# Altium schematic sheet Connectors.SchDoc: RasPiCompute_Connectors
size B; Engineer: Benjamin Beaudoin; Revision: v0.1
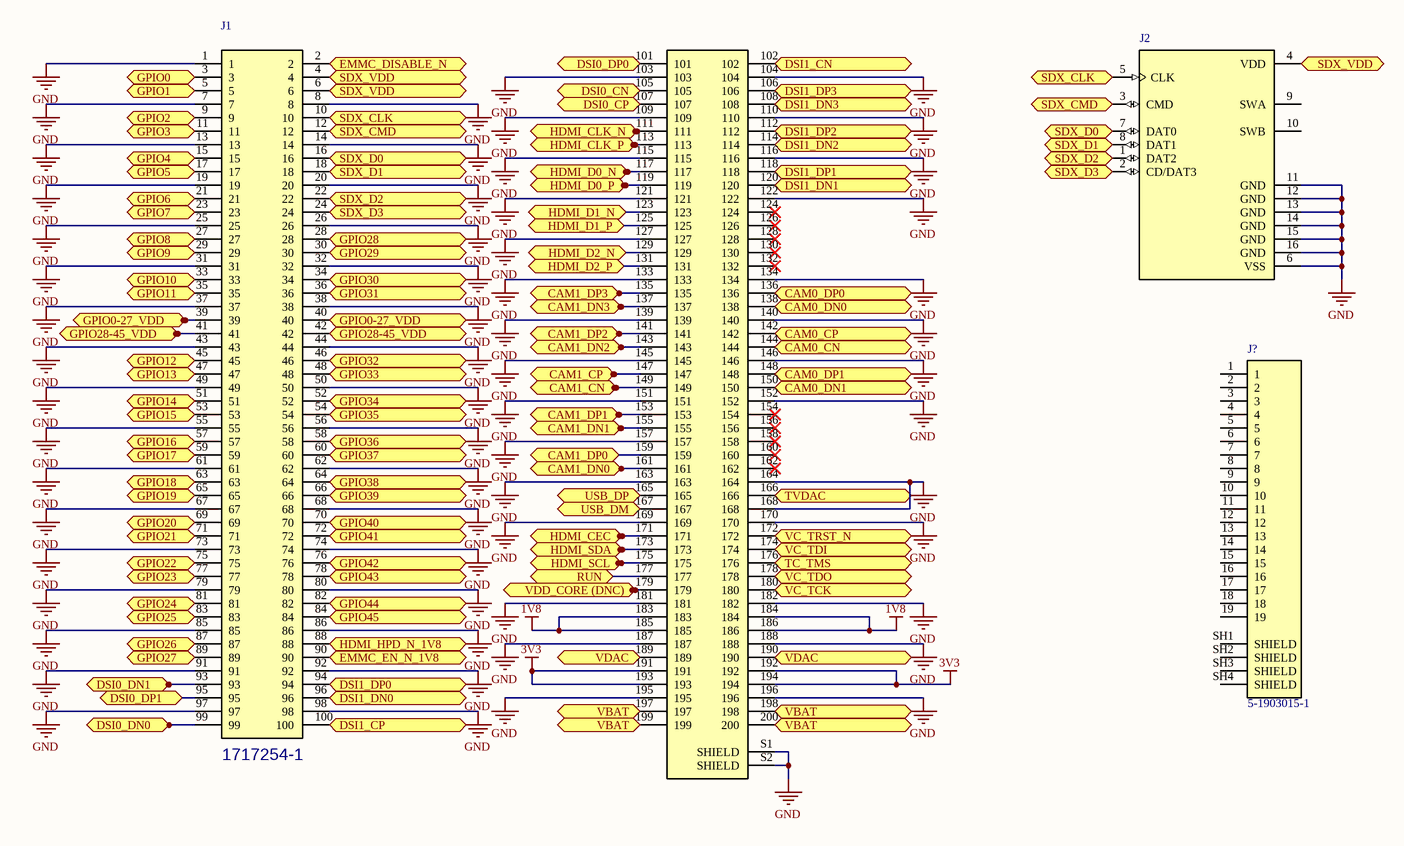
[diagram p0: Connectors.SchDoc]

## Parts
J1  1717254-1  [TE_1717254-1_1717254-1(Primary)]
J2  2201778-1  [TE_2201778-1]  (value not drawn)
J?  5-1903015-1  [TE_5-1903015-1_5-1903015-1(Primary)]

## Ports
CAM0_CN, CAM0_CP, CAM0_DN0, CAM0_DN1, CAM0_DP0, CAM0_DP1, CAM1_CN, CAM1_CP, CAM1_DN0, CAM1_DN1, CAM1_DN2, CAM1_DN3, CAM1_DP0, CAM1_DP1, CAM1_DP2, CAM1_DP3, DSI0_CN, DSI0_CP, DSI0_DN0, DSI0_DN1, DSI0_DP0, DSI0_DP1, DSI1_CN, DSI1_CP, DSI1_DN0, DSI1_DN1, DSI1_DN2, DSI1_DN3, DSI1_DP0, DSI1_DP1, DSI1_DP2, DSI1_DP3, EMMC_DISABLE_N, EMMC_EN_N_1V8, GPIO0, GPIO0-27_VDD, GPIO1, GPIO2, GPIO3, GPIO4, GPIO5, GPIO6, GPIO7, GPIO8, GPIO9, GPIO10, GPIO11, GPIO12, GPIO13, GPIO14, GPIO15, GPIO16, GPIO17, GPIO18, GPIO19, GPIO20, GPIO21, GPIO22, GPIO23, GPIO24, GPIO25, GPIO26, GPIO27, GPIO28, GPIO28-45_VDD, GPIO29, GPIO30, GPIO31, GPIO32, GPIO33, GPIO34, GPIO35, GPIO36, GPIO37, GPIO38, GPIO39, GPIO40, GPIO41, GPIO42, GPIO43, GPIO44, GPIO45, HDMI_CEC, HDMI_CLK_N, HDMI_CLK_P, HDMI_D0_N, HDMI_D0_P, HDMI_D1_N, HDMI_D1_P, HDMI_D2_N, HDMI_D2_P, HDMI_HPD_N_1V8, HDMI_SCL, HDMI_SDA, RUN, SDX_CLK, SDX_CMD, SDX_D0, SDX_D1, SDX_D2, SDX_D3, SDX_VDD, TC_TMS, TVDAC, USB_DM, USB_DP, VBAT, VC_TCK, VC_TDI, VC_TDO, VC_TRST_N, VDAC, VDD_CORE (DNC)

## Nets
1V8: J1.183 J1.184 J1.185 J1.186
3V3: J1.191 J1.192 J1.193 J1.194
GND: J1.1 J1.7 J1.8 J1.13 J1.14 J1.19 J1.20 J1.25 J1.26 J1.31 J1.32 J1.37 J1.38 J1.43 J1.44 J1.49 J1.50 J1.55 J1.56 J1.61 J1.62 J1.67 J1.68 J1.73 J1.74 J1.79 J1.80 J1.85 J1.86 J1.91 J1.92 J1.97 J1.98 J1.103 J1.104 J1.109 J1.110 J1.115 J1.116 J1.121 J1.122 J1.127 J1.133 J1.134 J1.139 J1.140 J1.145 J1.146 J1.151 J1.152 J1.157 J1.163 J1.164 J1.168 J1.169 J1.170 J1.181 J1.182 J1.187 J1.188 J1.195 J1.196 J1.S1(SHIELD) J1.S2(SHIELD) J2.6(VSS) J2.11(GND) J2.12(GND) J2.13(GND) J2.14(GND) J2.15(GND) J2.16(GND)
CAM0_CN: J1.144 ; port CAM0_CN
CAM0_CP: J1.142 ; port CAM0_CP
CAM0_DN0: J1.138 ; port CAM0_DN0
CAM0_DN1: J1.150 ; port CAM0_DN1
CAM0_DP0: J1.136 ; port CAM0_DP0
CAM0_DP1: J1.148 ; port CAM0_DP1
CAM1_CN: J1.149 ; port CAM1_CN
CAM1_CP: J1.147 ; port CAM1_CP
CAM1_DN0: J1.161 ; port CAM1_DN0
CAM1_DN1: J1.155 ; port CAM1_DN1
CAM1_DN2: J1.143 ; port CAM1_DN2
CAM1_DN3: J1.137 ; port CAM1_DN3
CAM1_DP0: J1.159 ; port CAM1_DP0
CAM1_DP1: J1.153 ; port CAM1_DP1
CAM1_DP2: J1.141 ; port CAM1_DP2
CAM1_DP3: J1.135 ; port CAM1_DP3
DSI0_CN: J1.105 ; port DSI0_CN
DSI0_CP: J1.107 ; port DSI0_CP
DSI0_DN0: J1.99 ; port DSI0_DN0
DSI0_DN1: J1.93 ; port DSI0_DN1
DSI0_DP0: J1.101 ; port DSI0_DP0
DSI0_DP1: J1.95 ; port DSI0_DP1
DSI1_CN: J1.102 ; port DSI1_CN
DSI1_CP: J1.100 ; port DSI1_CP
DSI1_DN0: J1.96 ; port DSI1_DN0
DSI1_DN1: J1.120 ; port DSI1_DN1
DSI1_DN2: J1.114 ; port DSI1_DN2
DSI1_DN3: J1.108 ; port DSI1_DN3
DSI1_DP0: J1.94 ; port DSI1_DP0
DSI1_DP1: J1.118 ; port DSI1_DP1
DSI1_DP2: J1.112 ; port DSI1_DP2
DSI1_DP3: J1.106 ; port DSI1_DP3
EMMC_DISABLE_N: J1.2 ; port EMMC_DISABLE_N
EMMC_EN_N_1V8: J1.90 ; port EMMC_EN_N_1V8
GPIO0: J1.3 ; port GPIO0
GPIO0-27_VDD: J1.39 J1.40 ; port GPIO0-27_VDD
GPIO1: J1.5 ; port GPIO1
GPIO2: J1.9 ; port GPIO2
GPIO3: J1.11 ; port GPIO3
GPIO4: J1.15 ; port GPIO4
GPIO5: J1.17 ; port GPIO5
GPIO6: J1.21 ; port GPIO6
GPIO7: J1.23 ; port GPIO7
GPIO8: J1.27 ; port GPIO8
GPIO9: J1.29 ; port GPIO9
GPIO10: J1.33 ; port GPIO10
GPIO11: J1.35 ; port GPIO11
GPIO12: J1.45 ; port GPIO12
GPIO13: J1.47 ; port GPIO13
GPIO14: J1.51 ; port GPIO14
GPIO15: J1.53 ; port GPIO15
GPIO16: J1.57 ; port GPIO16
GPIO17: J1.59 ; port GPIO17
GPIO18: J1.63 ; port GPIO18
GPIO19: J1.65 ; port GPIO19
GPIO20: J1.69 ; port GPIO20
GPIO21: J1.71 ; port GPIO21
GPIO22: J1.75 ; port GPIO22
GPIO23: J1.77 ; port GPIO23
GPIO24: J1.81 ; port GPIO24
GPIO25: J1.83 ; port GPIO25
GPIO26: J1.87 ; port GPIO26
GPIO27: J1.89 ; port GPIO27
GPIO28: J1.28 ; port GPIO28
GPIO28-45_VDD: J1.41 J1.42 ; port GPIO28-45_VDD
GPIO29: J1.30 ; port GPIO29
GPIO30: J1.34 ; port GPIO30
GPIO31: J1.36 ; port GPIO31
GPIO32: J1.46 ; port GPIO32
GPIO33: J1.48 ; port GPIO33
GPIO34: J1.52 ; port GPIO34
GPIO35: J1.54 ; port GPIO35
GPIO36: J1.58 ; port GPIO36
GPIO37: J1.60 ; port GPIO37
GPIO38: J1.64 ; port GPIO38
GPIO39: J1.66 ; port GPIO39
GPIO40: J1.70 ; port GPIO40
GPIO41: J1.72 ; port GPIO41
GPIO42: J1.76 ; port GPIO42
GPIO43: J1.78 ; port GPIO43
GPIO44: J1.82 ; port GPIO44
GPIO45: J1.84 ; port GPIO45
HDMI_CEC: J1.171 ; port HDMI_CEC
HDMI_CLK_N: J1.111 ; port HDMI_CLK_N
HDMI_CLK_P: J1.113 ; port HDMI_CLK_P
HDMI_D0_N: J1.117 ; port HDMI_D0_N
HDMI_D0_P: J1.119 ; port HDMI_D0_P
HDMI_D1_N: J1.123 ; port HDMI_D1_N
HDMI_D1_P: J1.125 ; port HDMI_D1_P
HDMI_D2_N: J1.129 ; port HDMI_D2_N
HDMI_D2_P: J1.131 ; port HDMI_D2_P
HDMI_HPD_N_1V8: J1.88 ; port HDMI_HPD_N_1V8
HDMI_SCL: J1.175 ; port HDMI_SCL
HDMI_SDA: J1.173 ; port HDMI_SDA
RUN: J1.177 ; port RUN
SDX_CLK: J1.10 J2.5(CLK) ; port SDX_CLK
SDX_CMD: J1.12 J2.3(CMD) ; port SDX_CMD
SDX_D0: J1.16 J2.7(DAT0) ; port SDX_D0
SDX_D1: J1.18 J2.8(DAT1) ; port SDX_D1
SDX_D2: J1.22 J2.1(DAT2) ; port SDX_D2
SDX_D3: J1.24 J2.2(CD/DAT3) ; port SDX_D3
SDX_VDD: J1.4 J1.6 J2.4(VDD) ; port SDX_VDD
TC_TMS: J1.176 ; port TC_TMS
TVDAC: J1.166 ; port TVDAC
USB_DM: J1.167 ; port USB_DM
USB_DP: J1.165 ; port USB_DP
VBAT: J1.197 J1.198 J1.199 J1.200 ; port VBAT
VC_TCK: J1.180 ; port VC_TCK
VC_TDI: J1.174 ; port VC_TDI
VC_TDO: J1.178 ; port VC_TDO
VC_TRST_N: J1.172 ; port VC_TRST_N
VDAC: J1.189 J1.190 ; port VDAC
VDD_CORE (DNC): J1.179 ; port VDD_CORE (DNC)

Not connected (* = marked no-connect by the designer): J1 124* 126* 128* 130* 132* 154* 156* 158* 160* 162*; J2 9(SWA) 10(SWB); J? 1 2 3 4 5 6 7 8 9 10 11 12 13 14 15 16 17 18 19 SH1(SHIELD) SH2(SHIELD) SH3(SHIELD) SH4(SHIELD)

## Library data of the parts
J1 = 1717254-1: EMBOSS ASS'Y DDR SODIMM SOCKET; Centerline_Pitch: .6 mm[.024 in]; MF: TE Connectivity; Number_of_Positions: 200; Product_Type: Socket; EU_RoHS_Compliance: Compliant; Digi-Key_Part_Number: A111047CT-ND; Package: None; Digi-Key_Purchase_URL: https://www.digikey.com/product-detail/en/te-connectivity-amp-connectors/1717254-1/A111047CT-ND/4142431?utm_source=snapeda&utm_medium=aggregator&utm_campaign=symbol; SnapEDA_Link: https://www.snapeda.com/parts/1717254-1/TE%20Connectivity%20AMP%20Connectors/view-part/?ref=snap; MP: 1717254-1; Link: http://www.te.com/usa-en/product-1717254-1.html; Value: *
J2 = 2201778-1: MICRO SD PUSH PUSH LOW PROFILE TYPE; Number_of_Positions: 8; Centerline_Pitch: 1.1 mm[.04 in]; MF: TE Connectivity; Product_Type: Removable Memory Products; MP: 2201778-1; Link: http://www.te.com/usa-en/product-2201778-1.html; SnapEDA_Link: https://www.snapeda.com/parts/2201778-1/TE%20Connectivity%20AMP%20Connectors/view-part/?ref=snap; Price: 2.18 USD; EU_RoHS_Compliance: Compliant; Package: None; Availability: Good; Value: *
J? = 5-1903015-1: Conn HDMI RCP 19 POS 0.5mm Solder RA SMD 19 Terminal 1 Port Embossed T/R; MF: TE Connectivity; Availability: Good; EU_RoHS_Compliance: Compliant; Price: 1.43 USD; Package: None; SnapEDA_Link: https://www.snapeda.com/parts/5-1903015-1/TE%20Connectivity%20AMP%20Connectors/view-part/?ref=snap; MP: 5-1903015-1; Link: http://www.te.com/usa-en/product-5-1903015-1.html; Value: *